# EAGLE design RHF0M301-PI-Adapter (EAGLE 7.6.0)
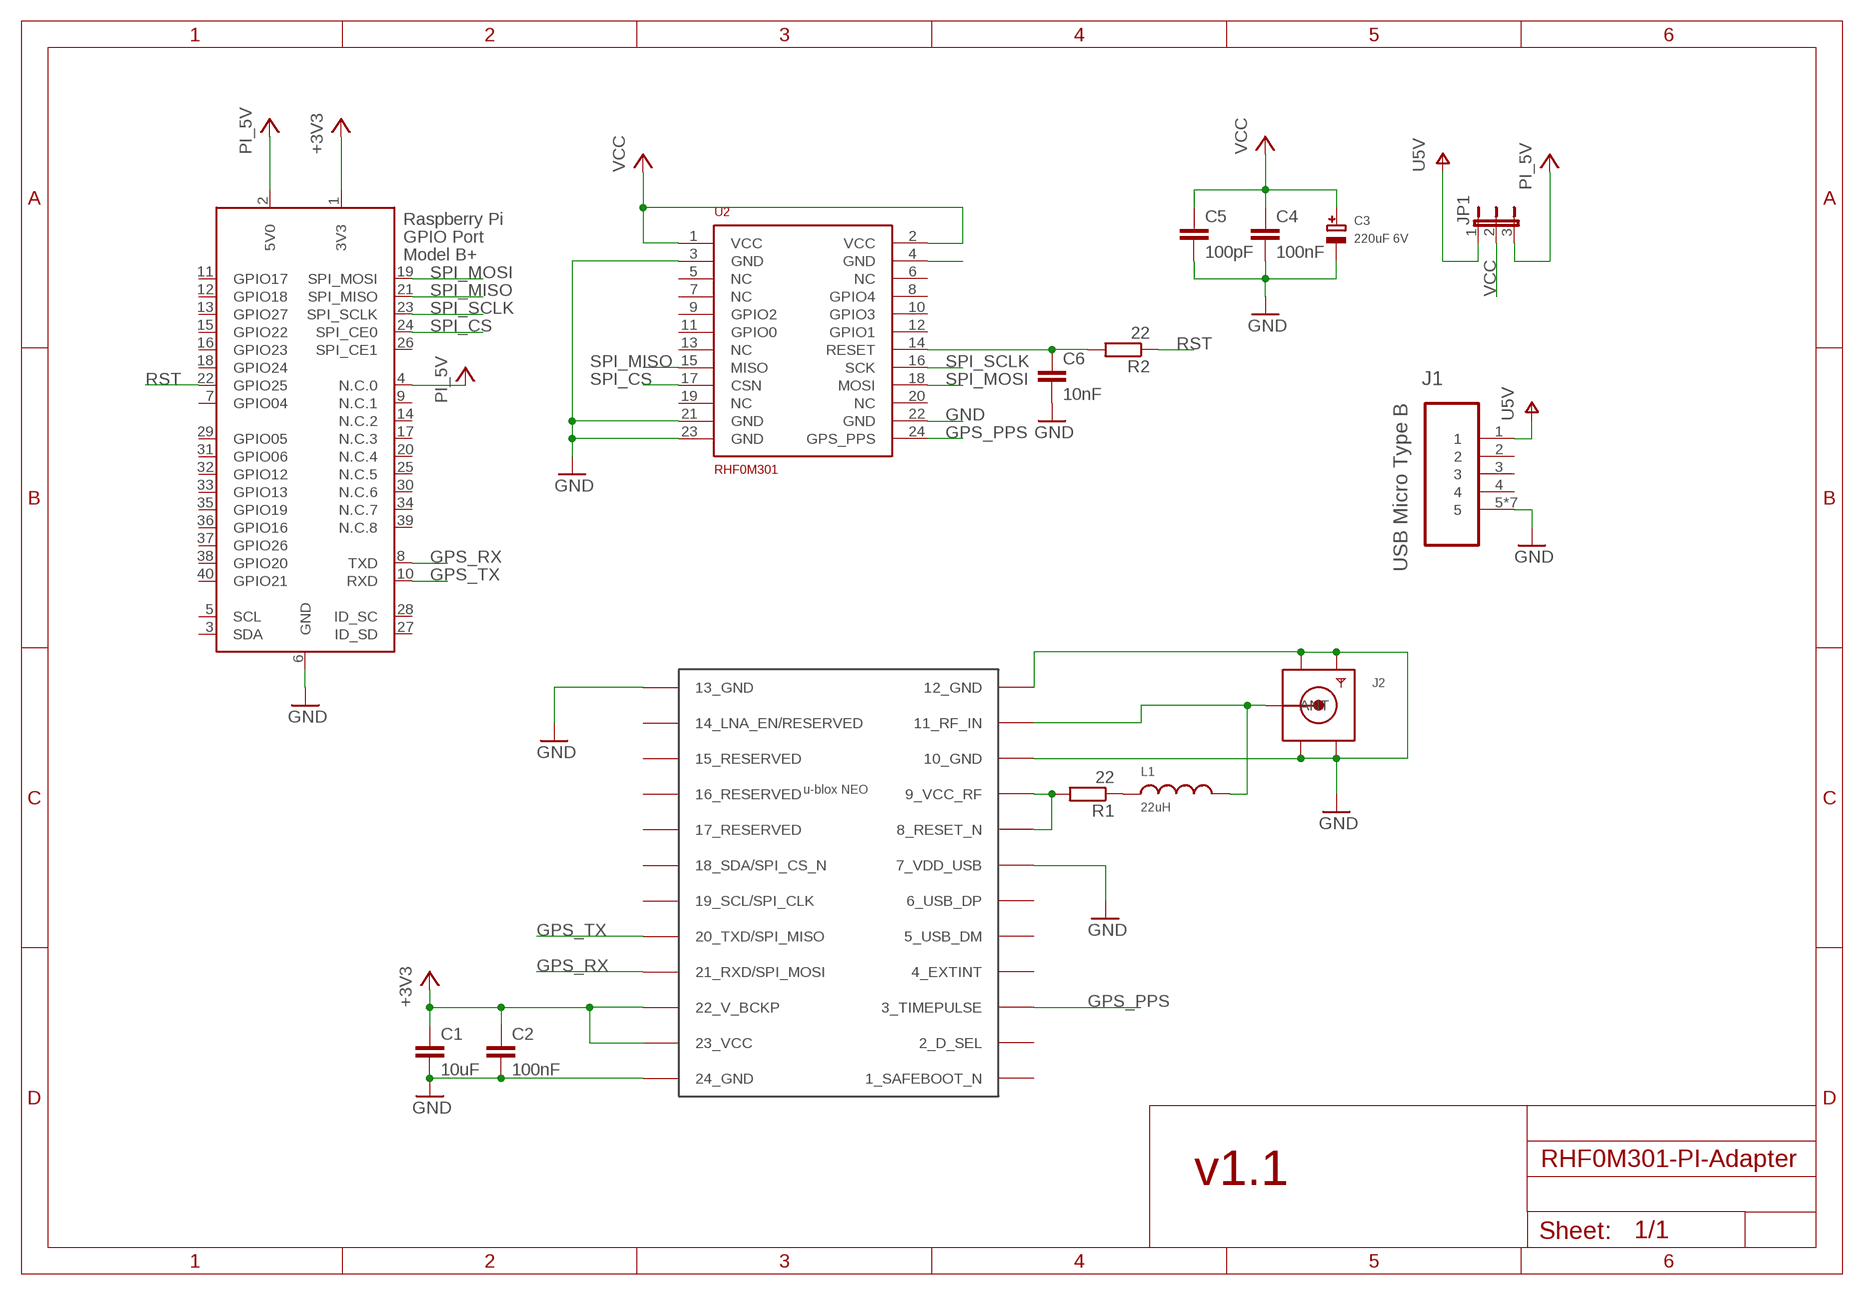
[diagram p0: schematic, sheet 1]

## Parts
C1  10uF  CAP0805  [0805_MP]
C2  100nF  CAP0603  [0603_MP]
C3  220uF 6V  CAP_TANTALUMC/6032_REFLOW  [EIA6032-28/C-R]
C4  100nF  CAP0603  [0603_MP]
C5  100pF  CAP0603  [0603_MP]
C6  10nF  CAP0603  [0603_MP]
J1  USB Micro Type B  47346-0001  [MOLEX_47346-0001]
J2  MICROBUILDER_SMACONNECTOR_EDGE_UFL  [MICROBUILDER_SMA_EDGELAUNCH_UFL]
JP1  JUMPER3  [JUMPER3]
L1  22uH  INDUCTOR0805  [R0805]
R1  22  RESISTOR0603  [0603_MP]
R2  22  RESISTOR0603  [0603_MP]
U1  NEO-M8  [NEO-M8]
U2  RHF0M301  [RFM0M301]
X2  RASPI_BOARD_B+_H  [RASPI_BOARD_B+HAT]

## Nets
+3V3: C1.1 C2.1 U1.22(22_V_BCKP) U1.23(23_VCC) X2.1(3V3)
+5V: JP1.3 X2.2(5V0) X2.4(N.C.0) ; supply symbol labelled PI_5V
GND: C1.2 C2.2 C3.- C4.2 C5.2 C6.2 J1.5 J1.M1 J1.M2 J1.M3 J1.M4 J1.M5 J1.M6 J2.GND@1(GND1) J2.GND@2(GND2) J2.GND@3(GND3) J2.GND@4(GND4) U1.7(7_VDD_USB) U1.10(10_GND) U1.12(12_GND) U1.13(13_GND) U1.24(24_GND) U2.3(GND) U2.4(GND) U2.21(GND) U2.22(GND) U2.23(GND) X2.6(GND)
GPS_PPS: U1.3(3_TIMEPULSE) U2.24(GPS_PPS)
GPS_RX: U1.21(21_RXD/SPI_MOSI) X2.8(TXD)
GPS_TX: U1.20(20_TXD/SPI_MISO) X2.10(RXD)
N$1: C6.1 R2.2 U2.14(RESET)
N$2: L1.1 R1.1
N$4: J2.P(ANT) L1.2 U1.11(11_RF_IN)
N$5: R1.2 U1.8(8_RESET_N) U1.9(9_VCC_RF)
RST: R2.1 X2.22(GPIO25)
SPI_CS: U2.17(CSN) X2.24(SPI_CE0)
SPI_MISO: U2.15(MISO) X2.21(SPI_MISO)
SPI_MOSI: U2.18(MOSI) X2.19(SPI_MOSI)
SPI_SCLK: U2.16(SCK) X2.23(SPI_SCLK)
V+: J1.1 JP1.1 ; supply symbol labelled U5V
VCC: C3.+ C4.1 C5.1 JP1.2 U2.1(VCC) U2.2(VCC)
Unconnected: J1.2 J1.3 J1.4 U1.1(1_SAFEBOOT_N) U1.2(2_D_SEL) U1.4(4_EXTINT) U1.5(5_USB_DM) U1.6(6_USB_DP) U1.14(14_LNA_EN/RESERVED) U1.15(15_RESERVED) U1.16(16_RESERVED) U1.17(17_RESERVED) U1.18(18_SDA/SPI_CS_N) U1.19(19_SCL/SPI_CLK) U2.5(NC) U2.6(NC) U2.7(NC) U2.8(GPIO4) U2.9(GPIO2) U2.10(GPIO3) U2.11(GPIO0) U2.12(GPIO1) U2.13(NC) U2.19(NC) U2.20(NC) X2.3(SDA) X2.5(SCL) X2.7(GPIO04) X2.9(N.C.1) X2.11(GPIO17) X2.12(GPIO18) X2.13(GPIO27) X2.14(N.C.2) X2.15(GPIO22) X2.16(GPIO23) X2.17(N.C.3) X2.18(GPIO24) X2.20(N.C.4) X2.25(N.C.5) X2.26(SPI_CE1) X2.27(ID_SD) X2.28(ID_SC) X2.29(GPIO05) X2.30(N.C.6) X2.31(GPIO06) X2.32(GPIO12) X2.33(GPIO13) X2.34(N.C.7) X2.35(GPIO19) X2.36(GPIO16) X2.37(GPIO26) X2.38(GPIO20) X2.39(N.C.8) X2.40(GPIO21)

## Notes on the sheet
- v1.1

## Library data of the parts
C1 C2 C4-C6 = #afb-Passives:CAP
C3 = microbuilder:CAP_TANTALUM: Tantalum Capacitors Wave footprints have larger pads and are meant to be used for hand soldering. Reflow footprints are optimised for solder paste and a reflow oven. EIA3216-18/A-[R/W] - Size A / 3216-18 / 1206 footprint 4.7µF 25V 10% Tantalum Capacitor 10µF 16V 10% Tantalum Capacitor [Digikey: 495-2236-2-ND] EIA3528-21/B-[R/W] - Size B / 3528-21 47µF 10V 10% Tantalum Capactior [Digikey: 495-2216-1-ND] EIA6032-28/C-[R/W] - Size C / 6032-28 10µF 35V 20% Tantalum Capacitor [Digikey: 495-2285-1-ND] 100µF 16V 10% Tantalum Capactior [Digikey: 399-5214-1-ND]
J1 = Molex-47346-0001:47346-0001: CONN RCPT 5POS MICRO USB R/A SMD; MPN: 47346-0001; OC_FARNELL: 1568026; OC_NEWARK: 47M0505; PACKAGE: 5 POS MICRO USB R/A; SUPPLIER: MOLEX
J2 = #afb-Connectors:MICROBUILDER_SMACONNECTOR: SMA Connector 90° DIP SMA Connector, 50 Ohm (4UConnector: 07259)
JP1 = microbuilder:JUMPER3: JUMPER - 3 Pins
L1 = #afb-Passives:INDUCTOR
R1 R2 = #afb-Passives:RESISTOR
U1 = ubloxLib:NEO-M8: u-blox NEO GNSS module
U2 = #afb-Boards:RHF0M301: LoRaWAN Gateway Module based on Semtech1301 from RisingHF
X2 = raspberrypi_bastelstube_v13:RASPI_BOARD_B+: Raspberry Pi GPIO connector with markings for the outer dimensions of the Raspberry Pi board model B+ with different sets of drill holes or mounting pads

## Board
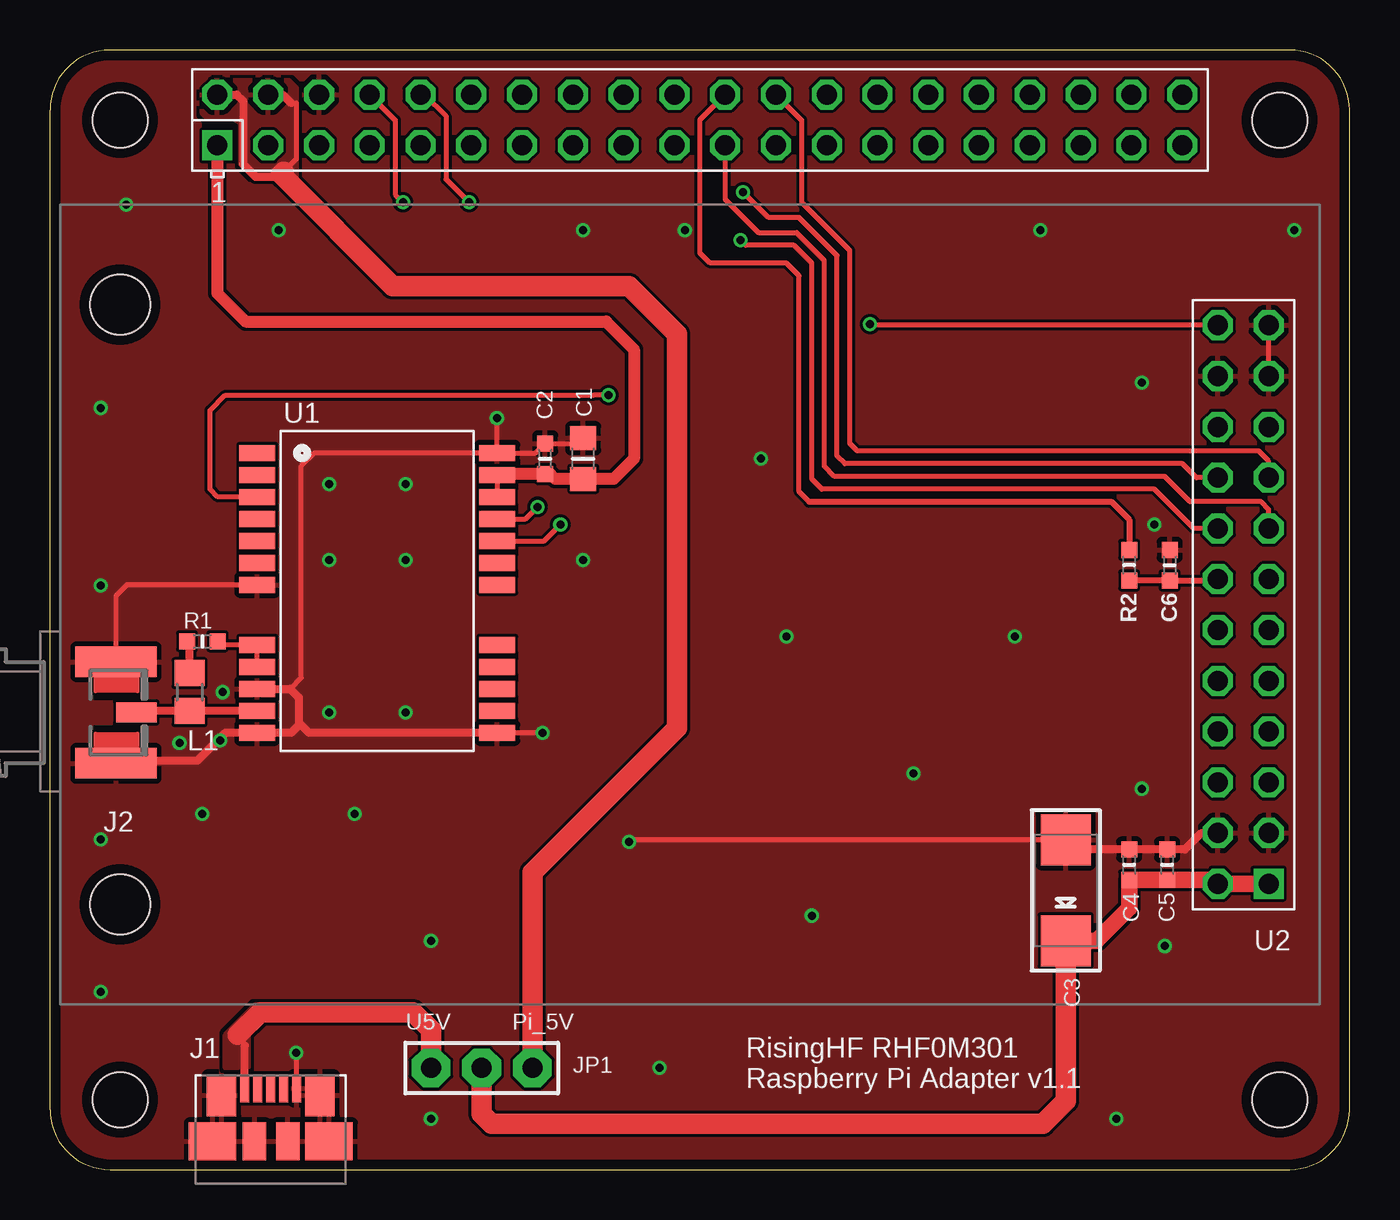
[diagram p1: board, top side]
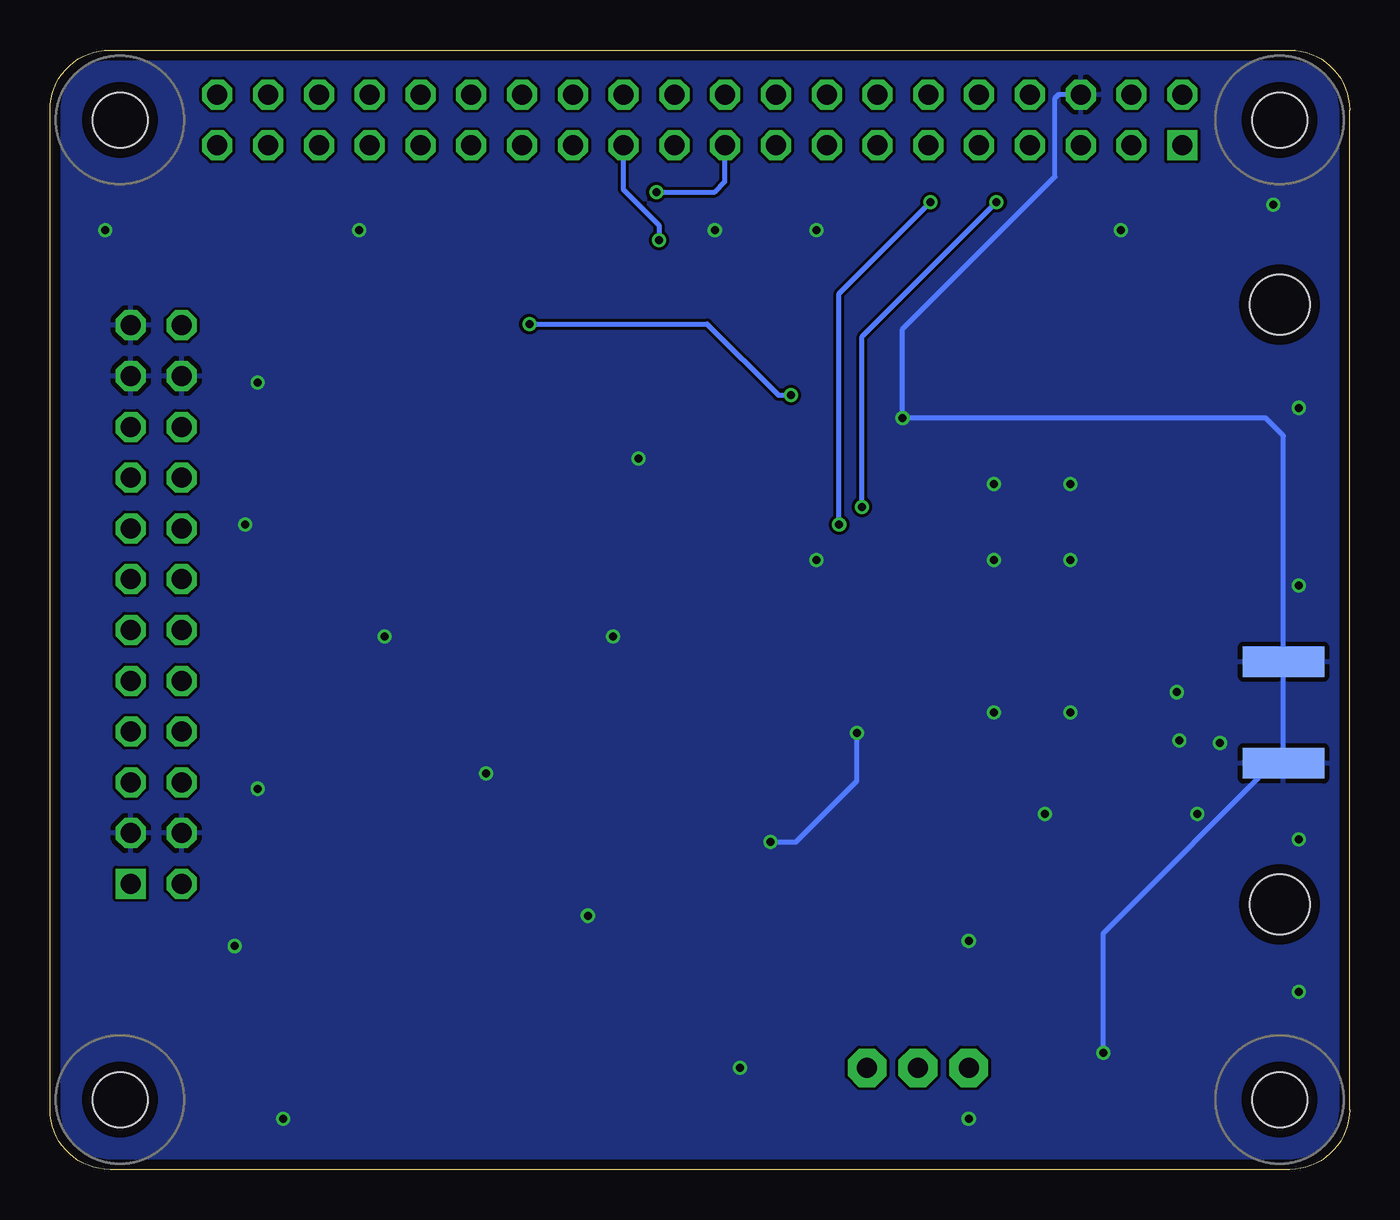
[diagram p2: board, bottom side, seen from below]

Size 65 x 56 mm. Coordinates in mm from the lower left corner, seen from the top.
Copper layers (1*16): Top 0.035mm / dielectric 1.6mm / Bottom 0.035mm
Design rules "Elecrow_2-layer_PCB_eagle_rule": minimum track width 6mil, minimum drill 12mil, track to track 6mil, track to pad 6mil, pad to pad 6mil, via to via 8mil, smd to smd 0mil, copper to edge 20mil, drill to drill 10mil, minimum pad ring 6mil, minimum via ring 6mil, stop-mask expansion 0mil, vias tented up to drill 100mil, thermal gap 10mil

### Footprints (pad centres in the part's own frame; a part is rotated, then mirrored left to right if it is on the bottom)
0805_MP = smd 1.2 x 1.3: 1 -1.016,0; 2 1.016,0
0603_MP = smd 0.8 x 0.8: 1 -0.762,0; 2 0.762,0
EIA6032-28/C-R = smd 2.55 x 2.5: + 2.525,0; - -2.525,0
MOLEX_47346-0001 = smd 0.45 x 1.38: 1 -1.3,0; 2 -0.65,0; 3 0,0; 4 0.65,0; 5 1.3,0 | smd 1.475 x 2.1: M1 -2.462,-0.36; M2 2.462,-0.36 | smd 2.375 x 1.9: M3 -2.913,-2.66; M6 2.913,-2.66 | smd 1.175 x 1.9: M4 -0.82,-2.66; M5 0.85,-2.66
MICROBUILDER_SMA_EDGELAUNCH_UFL = smd 4.064 x 1.524: GND@1 2.032,-2.54; GND@2 2.032,2.54 | smd 4.064 x 1.524 bottom: GND@3 2.032,2.54; GND@4 2.032,-2.54 | smd 2.032 x 1.016: P 3.048,0
JUMPER3 = drill 1 pad 1.93 octagon: 1 -2.54,0; 2 0,0; 3 2.54,0
R0805 = smd 1.3 x 1.5: 1 -0.95,0; 2 0.95,0
NEO-M8 = smd 1.8 x 0.8: 1 6.4,-7.4; 2 6.4,-6.3; 3 6.4,-5.2; 4 6.4,-4.1; 5 6.4,-3; 6 6.4,-1.9; 7 6.4,-0.8; 8 6.4,2.2; 9 6.4,3.3; 10 6.4,4.4; 11 6.4,5.5; 12 6.4,6.6; 13 -5.6,6.6; 14 -5.6,5.5; 15 -5.6,4.4; 16 -5.6,3.3; 17 -5.6,2.2; 18 -5.6,-0.8; 19 -5.6,-1.9; 20 -5.6,-3; 21 -5.6,-4.1; 22 -5.6,-5.2; 23 -5.6,-6.3; 24 -5.6,-7.4
RFM0M301 = drill 1 square: 1 2.54,33.97 | drill 1 octagon: 2 5.08,33.97; 3 2.54,31.43; 4 5.08,31.43; 5 2.54,28.89; 6 5.08,28.89; 7 2.54,26.35; 8 5.08,26.35; 9 2.54,23.81; 10 5.08,23.81; 11 2.54,21.27; 12 5.08,21.27; 13 2.54,18.73; 14 5.08,18.73; 15 2.54,16.19; 16 5.08,16.19; 17 2.54,13.65; 18 5.08,13.65; 19 2.54,11.11; 20 5.08,11.11; 21 2.54,8.57; 22 5.08,8.57; 23 2.54,6.03; 24 5.08,6.03 | hole 3: 60,5; 60,35
RASPI_BOARD_B+HAT = drill 1 square: 1 8.37,51.23 | drill 1 octagon: 2 8.37,53.77; 3 10.91,51.23; 4 10.91,53.77; 5 13.45,51.23; 6 13.45,53.77; 7 15.99,51.23; 8 15.99,53.77; 9 18.53,51.23; 10 18.53,53.77; 11 21.07,51.23; 12 21.07,53.77; 13 23.61,51.23; 14 23.61,53.77; 15 26.15,51.23; 16 26.15,53.77; 17 28.69,51.23; 18 28.69,53.77; 19 31.23,51.23; 20 31.23,53.77; 21 33.77,51.23; 22 33.77,53.77; 23 36.31,51.23; 24 36.31,53.77; 25 38.85,51.23; 26 38.85,53.77; 27 41.39,51.23; 28 41.39,53.77; 29 43.93,51.23; 30 43.93,53.77; 31 46.47,51.23; 32 46.47,53.77; 33 49.01,51.23; 34 49.01,53.77; 35 51.55,51.23; 36 51.55,53.77; 37 54.09,51.23; 38 54.09,53.77; 39 56.63,51.23; 40 56.63,53.77 | hole 2.75: 3.5,3.5; 3.5,52.5; 61.5,3.5; 61.5,52.5

### Placement (x,y rotation side)
C1  26.67,35.56 90 top
C2  24.77,35.56 90 top
C3  50.8,13.97 270 top
C4  53.98,15.24 90 top
C5  55.88,15.24 90 top
C6  56.01,30.23 90 top
J1  11.05,4.06 0 top
J2  1.27,22.86 0 top
JP1  21.59,5.08 0 top
L1  6.99,23.88 270 top
R1  7.62,26.42 0 top
R2  53.98,30.23 270 top
U1  16.76,28.45 180 top
U2  63.5,48.26 180 top
X2  0,0 0 top

### Tracks (layer width: path | path; a pad name or v marks a point on that pad's centre or on a via)
+3V3
  Top 0.254: 22.41,34.8 U1.23 U1.22
  Top 0.61: X2.1 8.37,43.83 9.78,42.42 27.81,42.42 29.21,41.02 29.21,35.56 28.19,34.54 C1.1 25.27,34.54 25.02,34.8 C2.1 22.41,34.8
+5V
  Top 0.254: 12.06,53.34 12.32,53.34 12.32,50.55 11.56,49.78
  Top 0.406: X2.2 9.35,53.77 9.65,53.47 9.65,50.29 10.29,49.66 11.68,49.66 | X2.4 11.63,53.77 12.06,53.34
  Top 1.016: JP1.3 24.13,14.86 31.37,22.1 31.37,41.78 28.96,44.2 17.14,44.2 11.56,49.78 11.68,49.91 11.68,49.66
  pour Top: 8,54.48 11.94,54.48 12.32,54.1 12.32,49.66 10.16,49.66 9.53,50.29 9.53,52.32 9.14,52.58 7.87,52.58 7.62,52.83 7.62,54.1
GND  (via drill 0.4)
  Top 0.254: C1.2 26.42,36.32 C2.2 24.29,35.85 U1.24 | 12.02,24.05 12.57,24.6 12.57,35.18 13.24,35.85 U1.24 | U2.21 U2.23 | U1.24 22.36,37.58 v22.35,37.59 | J1.5 12.35,5.81 v12.32,5.84 | C3.- 29.07,16.5 v28.96,16.38 | v24.64,21.84 U1.13 | U1.7 3.85,29.25 3.3,28.7 J2.GND@3
  Top 0.406: U1.10 12.02,24.05 12.45,23.62 12.45,22.35 | 12.45,22.35 12.45,22.23 12.06,21.84 U1.12 8.77,21.85 7.37,20.45 4.06,20.45 3.94,20.32 J2.GND@4 | U1.13 12.95,21.85 12.45,22.35 | 57.6,16.83 56.77,16 C5.2 C4.2 51.29,16
  Bottom 0.254: X2.6 14.56,53.77 14.73,53.59 14.73,49.66 22.35,42.04 v22.35,37.59 4.19,37.59 3.3,36.7 J2.GND@3 3.3,20.83 | J2.GND@4 3.3,20.83 | v12.32,5.84 12.32,11.81 3.3,20.83 | v28.96,16.38 27.69,16.38 24.64,19.43 v24.64,21.84
  other vias: 26.67,46.99 31.75,46.99 13.97,34.29 13.97,30.48 17.78,34.29 17.78,30.48 13.97,22.86 17.78,22.86 26.67,30.48 7.62,17.78 15.24,17.78 36.83,26.67 48.26,26.67 38.1,12.7 30.48,5.08 53.34,2.54 19.05,2.54 54.61,19.05 54.61,39.37 62.23,46.99 2.54,38.1 2.54,29.21 2.54,16.51 2.54,8.89 35.56,35.56 49.53,46.99 3.81,48.26 11.43,46.99 19.05,11.43 8.64,23.88 8.51,21.46 6.48,21.34 55.24,32.26 55.75,11.18 43.18,19.81
  pour Top (rank 6): 0,55.88 64.77,55.88 64.77,0 0,0
  pour Bottom (rank 6): 1.27,55.88 64.77,55.88 64.77,1.27 64.77,0 0,0 0,55.88
GPS_PPS  (via drill 0.4)
  Top 0.254: U1.3 8.39,33.65 8,34.04 8,37.97 8.76,38.73 27.18,38.73 v27.94,38.73 | U2.24 41.08,42.23 v41.02,42.29
  Bottom 0.254: v41.02,42.29 32.13,42.29 28.57,38.73 v27.94,38.73
GPS_RX  (via drill 0.4)
  Top 0.254: U1.21 23.79,32.55 v24.38,33.15 | X2.8 17.27,52.49 17.27,48.77 v17.65,48.39
  Bottom 0.254: v24.38,33.15 24.38,41.66 v17.65,48.39
GPS_TX  (via drill 0.4)
  Top 0.254: X2.10 18.75,53.77 19.81,52.7 19.81,49.53 v20.95,48.39 | U1.20 24.72,31.45 v25.53,32.26
  Bottom 0.254: v25.53,32.26 25.53,43.81 v20.95,48.39
N$1
  Top 0.305: U2.14 58.35,29.46 C6.1 R2.2
N$2
  Top 0.406: L1.1 6.99,26.29 R1.1
N$4
  Top 0.406: J2.P 4.38,22.93 L1.2 7.01,22.95 U1.11
N$5
  Top 0.254: R1.2 8.55,26.25 U1.8 U1.9
RST
  Top 0.254: 37.97,33.4 37.47,33.91 37.47,44.7 36.83,45.34 33.02,45.34 32.51,45.85 32.51,52.51 X2.22
  Top 0.305: 37.97,33.4 53.09,33.4 53.98,32.51 R2.1
SPI_CS
  Top 0.254: U2.17 60.96,35.43 60.45,35.94 40.39,35.94 40.01,36.32 40.01,45.97 37.59,48.39 37.59,52.49 X2.24
SPI_MISO
  Top 0.254: U2.15 60.96,33.02 60.58,33.4 57.02,33.4 55.75,34.67 39.24,34.67 38.73,35.18 38.73,45.47 37.34,46.86 35.43,46.86 33.77,48.53 X2.21
SPI_MOSI  (via drill 0.4)
  Top 0.254: U2.18 57.34,34.61 56.64,35.31 39.75,35.31 39.37,35.69 39.37,45.72 37.47,47.62 35.94,47.62 v34.67,48.9
  Bottom 0.254: X2.19 31.24,51.22 31.24,49.4 31.75,48.9 v34.67,48.9
SPI_SCLK  (via drill 0.4)
  Top 0.254: U2.16 57.21,32.07 55.24,34.04 38.61,34.04 38.1,34.54 38.1,45.34 37.21,46.23 34.8,46.23 v34.54,46.48
  Bottom 0.254: X2.23 36.32,51.22 36.32,49.02 34.54,47.24 v34.54,46.48
V+
  Top 0.406: J1.1 9.75,6.19
  Top 1.016: JP1.1 19.05,6.99 18.16,7.87 10.54,7.87 9.4,6.73
  pour Top: 9.91,6.86 9.91,5.08 8.76,5.08 8.76,6.48 8.76,6.73 10.29,8.26 10.54,8.26 10.67,8.13 10.67,7.62
VCC
  Top 0.406: 50.78,11.43 C3.+
  Top 0.813: U2.1 U2.2 58.23,14.48 C5.1 C4.1 53.98,13.08 52.34,11.45 C3.+
  Top 1.016: JP1.2 21.59,2.79 22.1,2.29 49.66,2.29 50.8,3.43 C3.+

### Text on the board
tNames: U5V | Pi_5V | RisingHF RHF0M301 / Raspberry Pi Adapter v1.1